# EAGLE schematic EurorackSP32 (EAGLE 9.6.2)
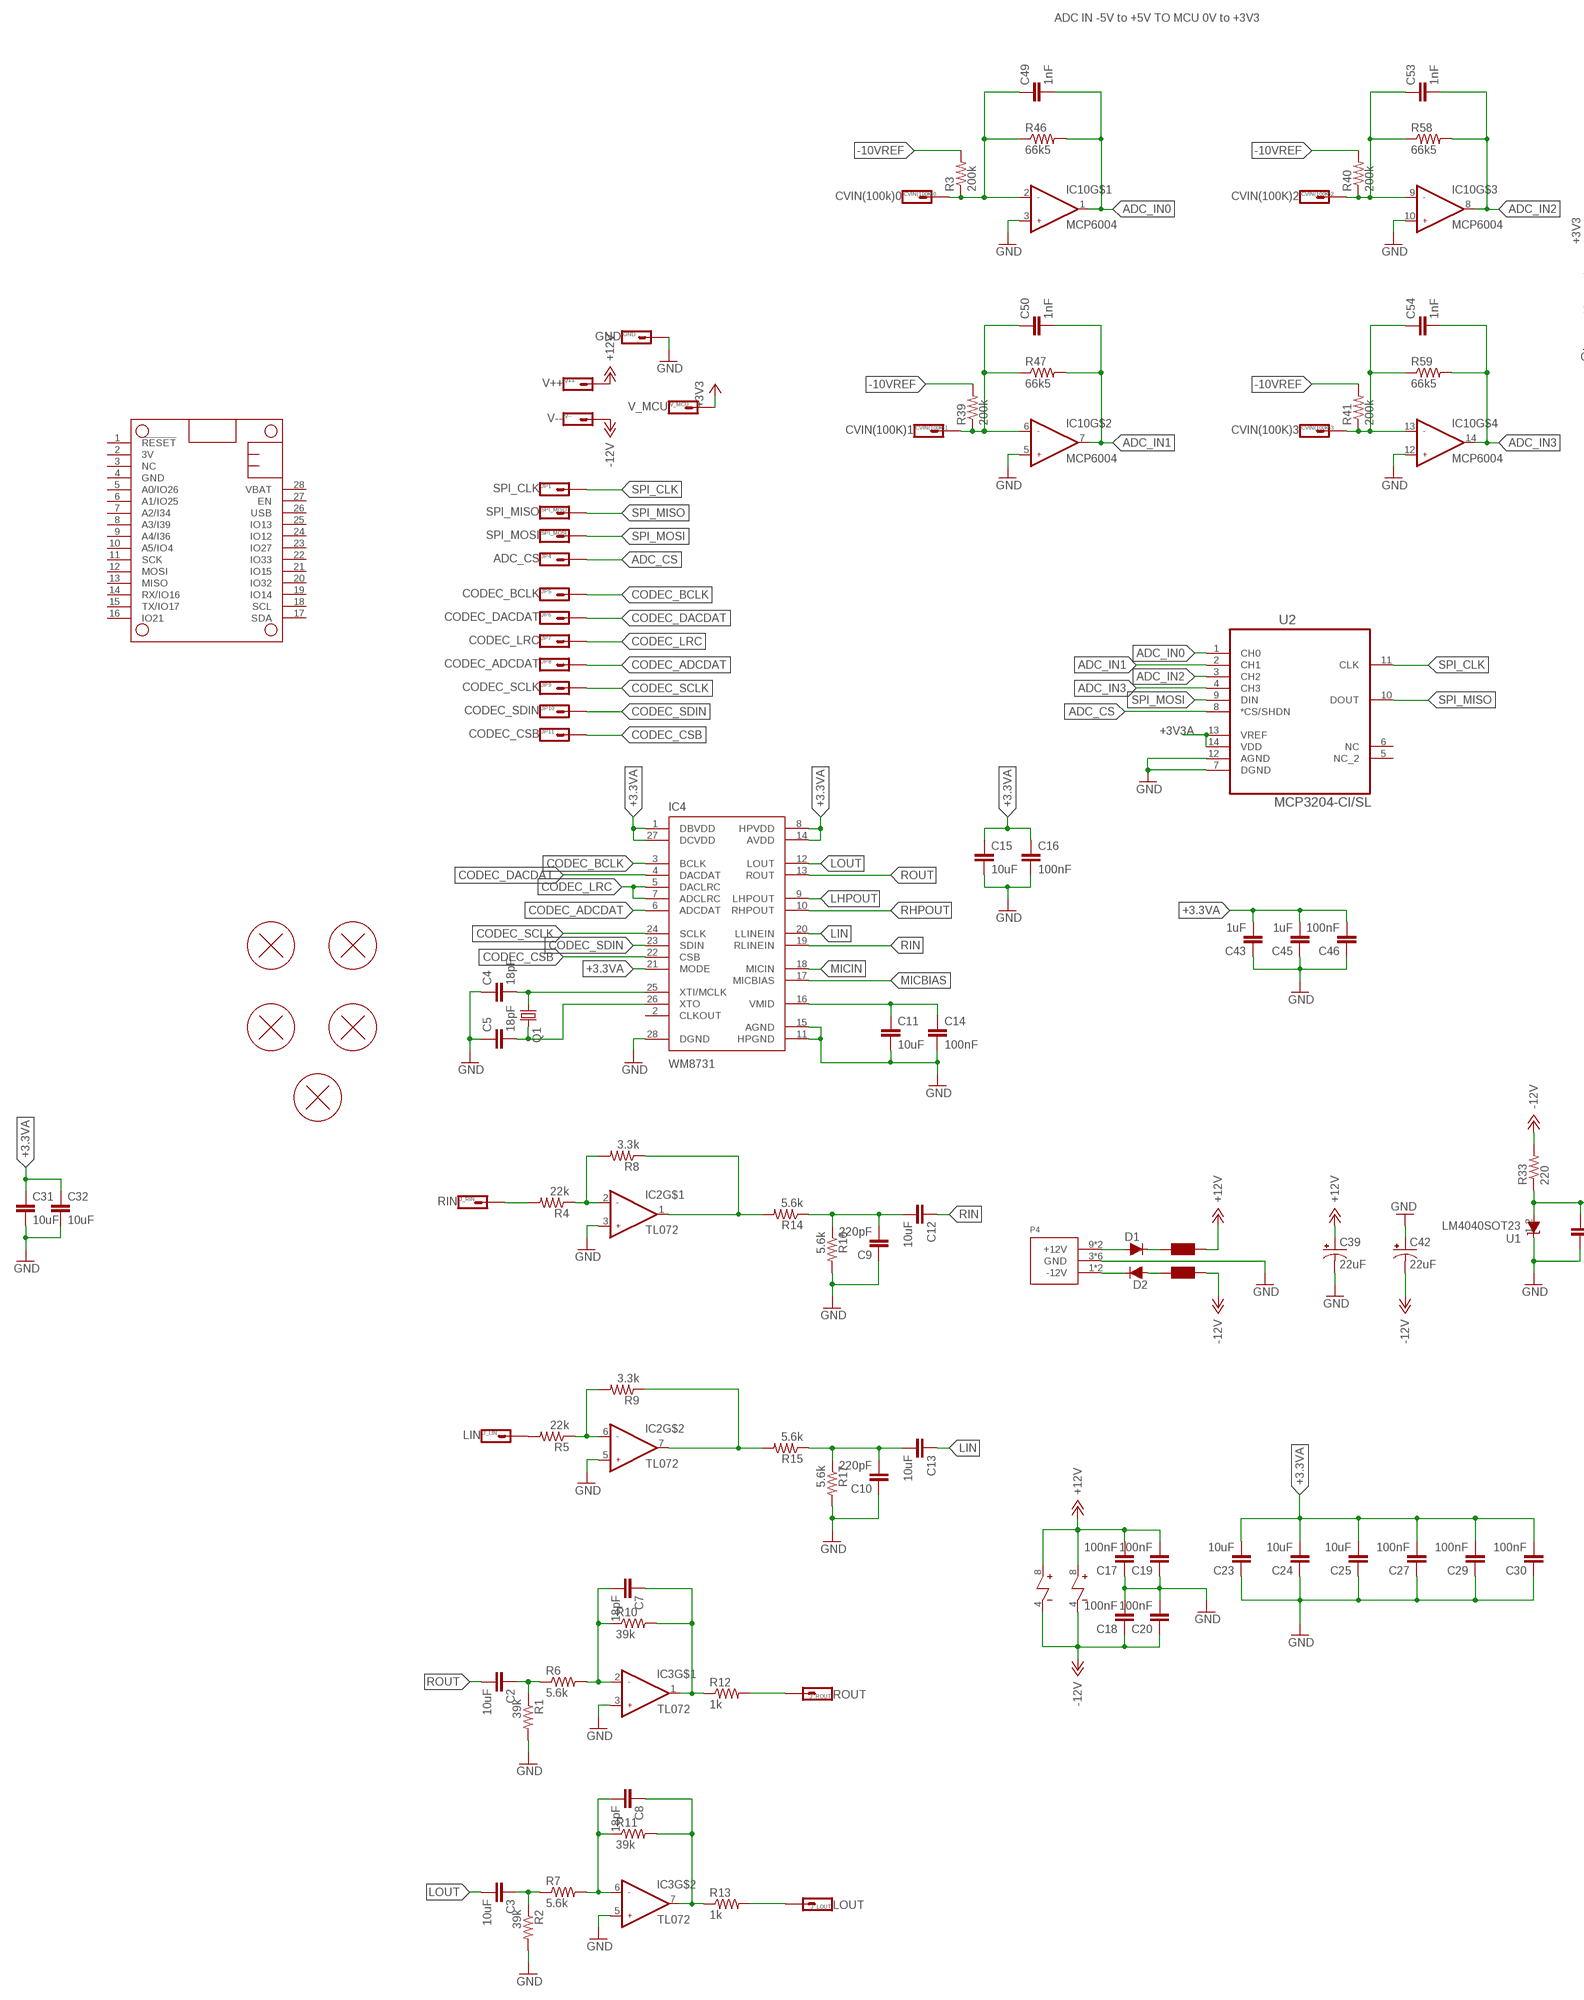
[diagram p0: schematic, sheet 1, part 1 of 2]
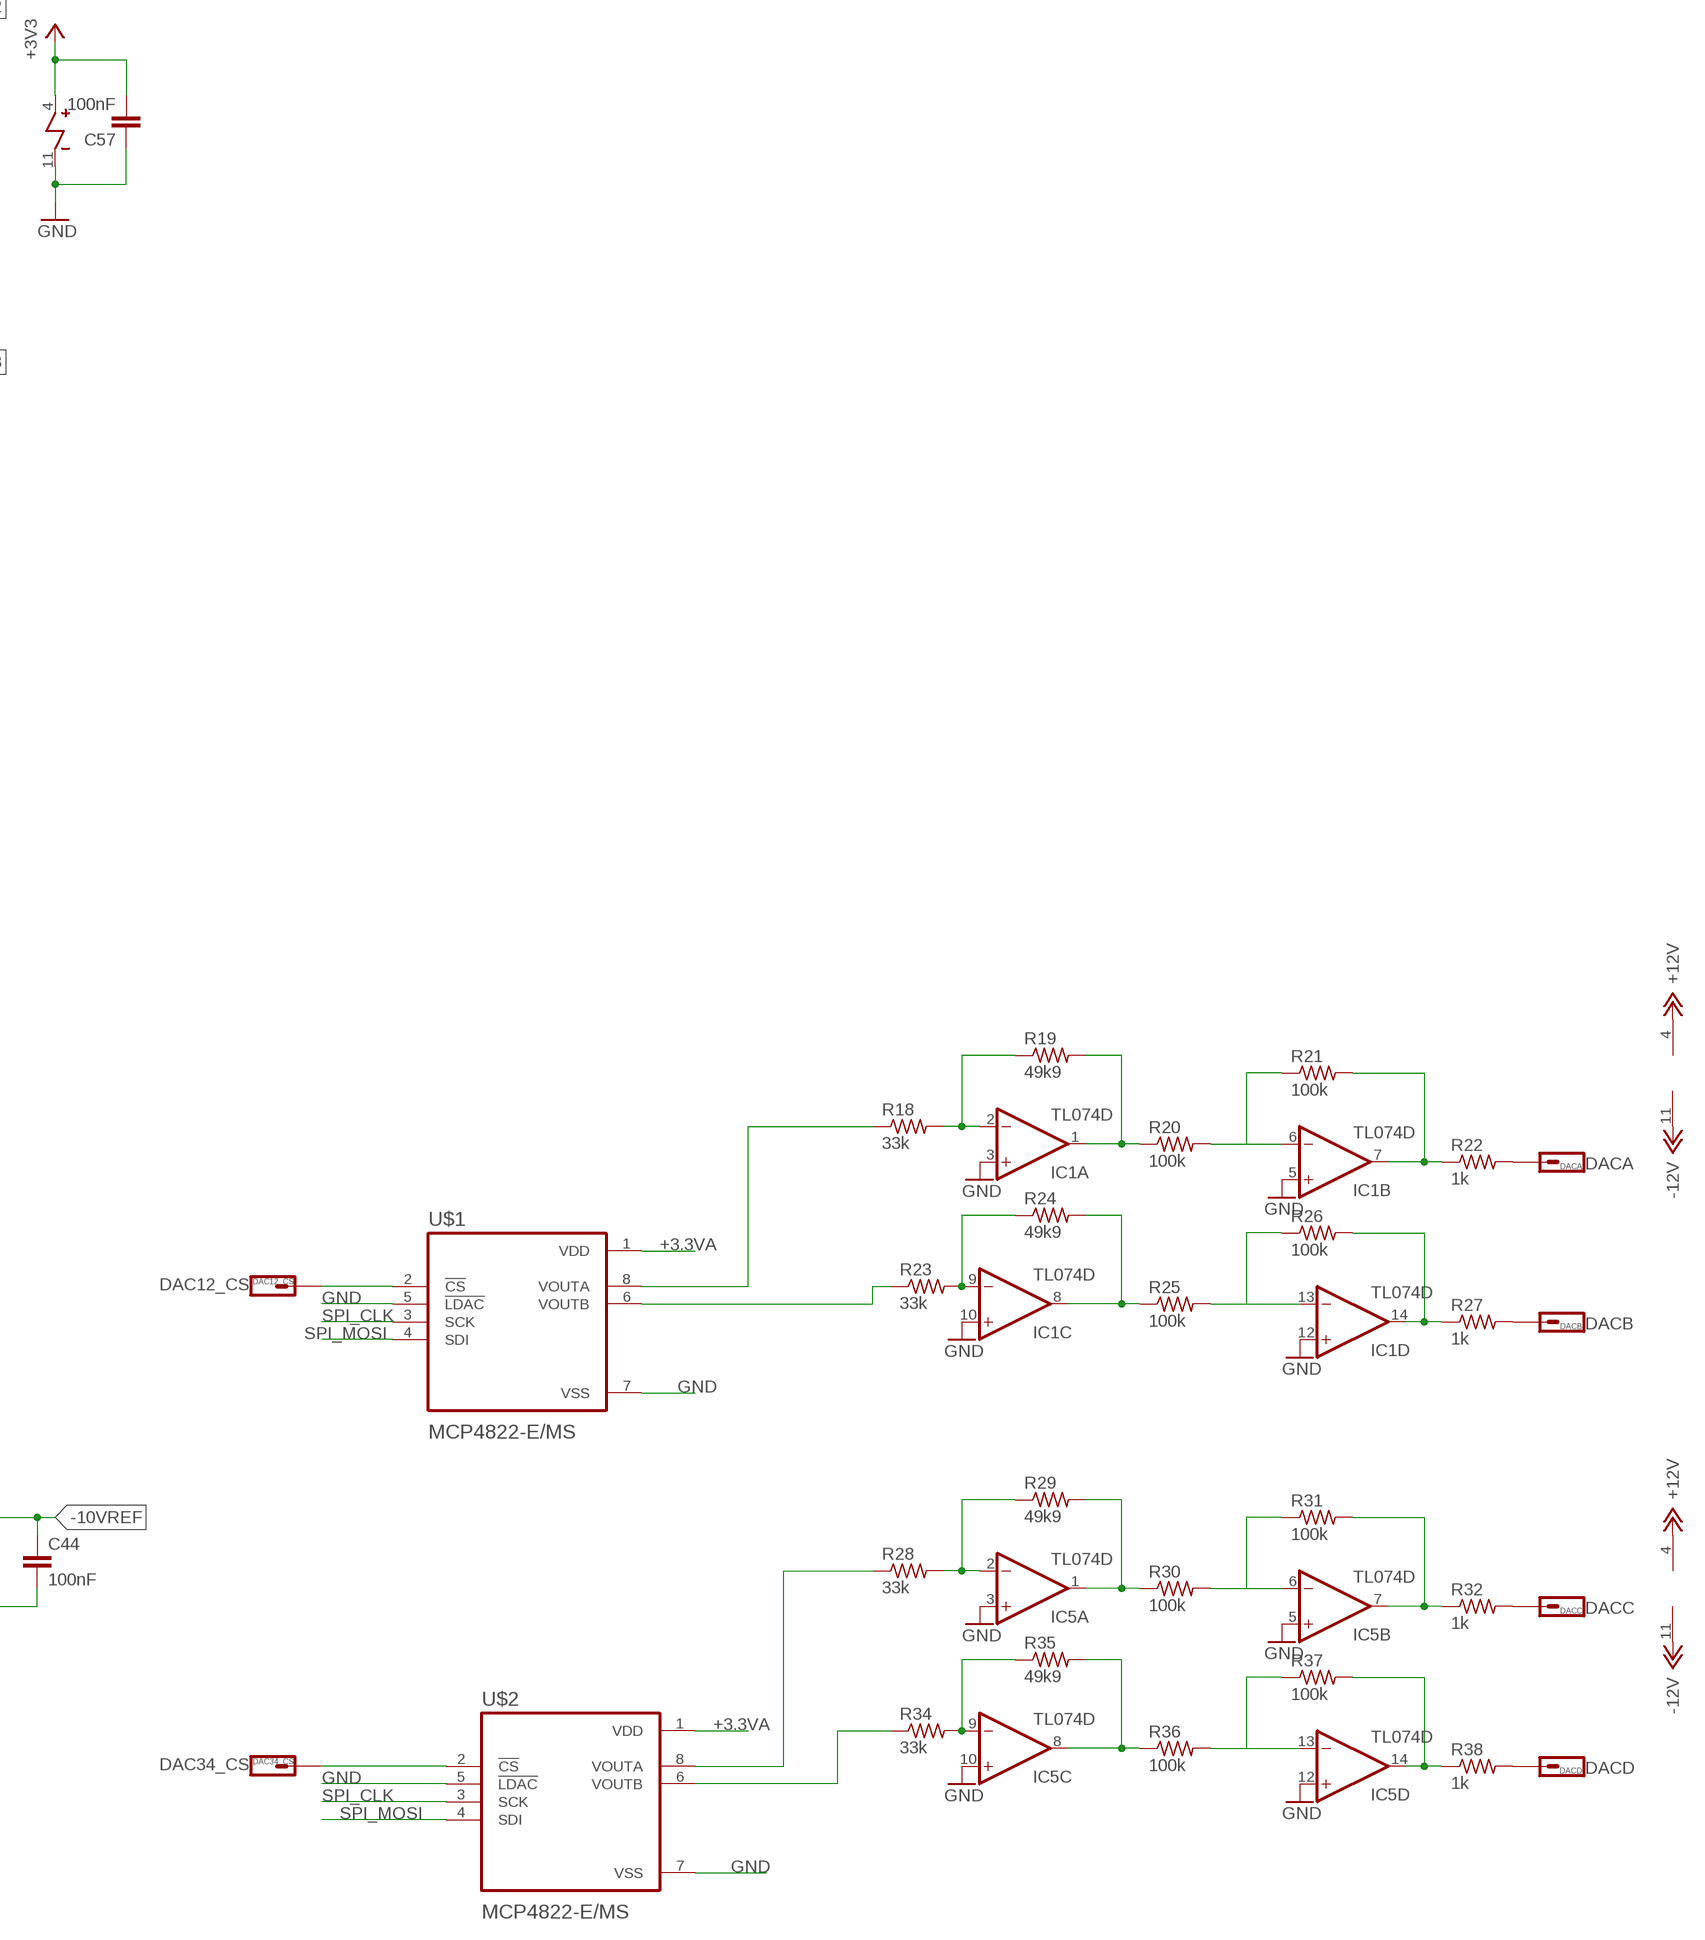
[diagram p1: schematic, sheet 1, part 2 of 2]

## Parts
C2  10uF  CAPACITOR0805  [R0805]
C3  10uF  CAPACITOR0805  [R0805]
C4  18pF  CAPACITOR  [RESISTOR_0603]
C5  18pF  CAPACITOR  [RESISTOR_0603]
C7  18pF  CAPACITOR  [RESISTOR_0603]
C8  18pF  CAPACITOR  [RESISTOR_0603]
C9  220pF  CAPACITOR  [RESISTOR_0603]
C10  220pF  CAPACITOR  [RESISTOR_0603]
C11  10uF  CAPACITOR0805  [R0805]
C12  10uF  CAPACITOR0805  [R0805]
C13  10uF  CAPACITOR0805  [R0805]
C14  100nF  CAPACITOR  [RESISTOR_0603]
C15  10uF  CAPACITOR0805  [R0805]
C16  100nF  CAPACITOR  [RESISTOR_0603]
C17  100nF  CAPACITOR  [RESISTOR_0603]
C18  100nF  CAPACITOR  [RESISTOR_0603]
C19  100nF  CAPACITOR  [RESISTOR_0603]
C20  100nF  CAPACITOR  [RESISTOR_0603]
C23  10uF  CAPACITOR0805  [R0805]
C24  10uF  CAPACITOR0805  [R0805]
C25  10uF  CAPACITOR0805  [R0805]
C27  100nF  CAPACITOR  [RESISTOR_0603]
C29  100nF  CAPACITOR  [RESISTOR_0603]
C30  100nF  CAPACITOR  [RESISTOR_0603]
C31  10uF  CAPACITOR0805  [R0805]
C32  10uF  CAPACITOR0805  [R0805]
C39  22uF  CAP_POL1206_TANT  [1206_POL]
C42  22uF  CAP_POL1206_TANT  [1206_POL]
C43  1uF  CAPACITOR  [RESISTOR_0603]
C44  100nF  CAPACITOR  [RESISTOR_0603]
C45  1uF  CAPACITOR  [RESISTOR_0603]
C46  100nF  CAPACITOR  [RESISTOR_0603]
C49  1nF  CAPACITOR  [RESISTOR_0603]
C50  1nF  CAPACITOR  [RESISTOR_0603]
C53  1nF  CAPACITOR  [RESISTOR_0603]
C54  1nF  CAPACITOR  [RESISTOR_0603]
C57  100nF  CAPACITOR  [RESISTOR_0603]
CVIN(100K)0  CVIN(100k)0  HEADER-1X1  [1X01_SIDE_NAME]
CVIN(100K)1  CVIN(100K)1  HEADER-1X1  [1X01_SIDE_NAME]
CVIN(100K)2  CVIN(100K)2  HEADER-1X1  [1X01_SIDE_NAME]
CVIN(100K)3  CVIN(100K)3  HEADER-1X1  [1X01_SIDE_NAME]
D1  DIODE  [SOD123]
D2  DIODE  [SOD123]
DAC12_CS  DAC12_CS  HEADER-1X1  [1X01_SIDE_NAME]
DAC34_CS  DAC34_CS  HEADER-1X1  [1X01_SIDE_NAME]
DACA  DACA  HEADER-1X1  [1X01_SIDE_NAME]
DACB  DACB  HEADER-1X1  [1X01_SIDE_NAME]
DACC  DACC  HEADER-1X1  [1X01_SIDE_NAME]
DACD  DACD  HEADER-1X1  [1X01_SIDE_NAME]
F1  FERRITE-BEAD0805  [R0805]
F2  FERRITE-BEAD0805  [R0805]
GND  GND  HEADER-1X1  [1X01_SIDE_NAME]
H1  PCB_SCREW  [PCB_SCREW]
H2  PCB_SCREW  [PCB_SCREW]
H3  PCB_SCREW  [PCB_SCREW]
H4  PCB_SCREW  [PCB_SCREW]
H5  PCB_SCREW  [PCB_SCREW]
IC1  TL074D  [SO14]
IC2  TL072  OPAMP_DUAL  [SOIC8]
IC3  TL072  OPAMP_DUAL  [SOIC8]
IC4  WM8731  [SSOP28]
IC5  TL074D  [SO14]
IC10  MCP6004  OPAMP_QUADPWR  [TSSOP14]
J_LIN  LIN  HEADER-1X1  [1X01_SIDE_NAME]
J_LOUT  LOUT  HEADER-1X1  [1X01_SIDE_NAME]
J_RIN  RIN  HEADER-1X1  [1X01_SIDE_NAME]
J_ROUT  ROUT  HEADER-1X1  [1X01_SIDE_NAME]
JP1  SPI_CLK  HEADER-1X1  [1X01_SIDE_NAME]
JP4  ADC_CS  HEADER-1X1  [1X01_SIDE_NAME]
JP5  CODEC_BCLK  HEADER-1X1  [1X01_SIDE_NAME]
JP6  CODEC_DACDAT  HEADER-1X1  [1X01_SIDE_NAME]
JP7  CODEC_LRC  HEADER-1X1  [1X01_SIDE_NAME]
JP8  CODEC_ADCDAT  HEADER-1X1  [1X01_SIDE_NAME]
JP9  CODEC_SCLK  HEADER-1X1  [1X01_SIDE_NAME]
JP10  CODEC_SDIN  HEADER-1X1  [1X01_SIDE_NAME]
JP11  CODEC_CSB  HEADER-1X1  [1X01_SIDE_NAME]
MS2  FEATHER_HUZZAH32NO_DRILL  [FEATHERWING_NODRILL]
P4  POWER_SIMPLE10  [POWER_10]
Q1  CRYSTAL  [HC49UP]
R1  39k  RESISTOR  [RESISTOR_0603]
R2  39k  RESISTOR  [RESISTOR_0603]
R3  200k  RESISTOR  [RESISTOR_0603]
R4  22k  RESISTOR  [RESISTOR_0603]
R5  22k  RESISTOR  [RESISTOR_0603]
R6  5.6k  RESISTOR  [RESISTOR_0603]
R7  5.6k  RESISTOR  [RESISTOR_0603]
R8  3.3k  RESISTOR  [RESISTOR_0603]
R9  3.3k  RESISTOR  [RESISTOR_0603]
R10  39k  RESISTOR  [RESISTOR_0603]
R11  39k  RESISTOR  [RESISTOR_0603]
R12  1k  RESISTOR  [RESISTOR_0603]
R13  1k  RESISTOR  [RESISTOR_0603]
R14  5.6k  RESISTOR  [RESISTOR_0603]
R15  5.6k  RESISTOR  [RESISTOR_0603]
R16  5.6k  RESISTOR  [RESISTOR_0603]
R17  5.6k  RESISTOR  [RESISTOR_0603]
R18  33k  RESISTOR  [RESISTOR_0603]
R19  49k9  RESISTOR  [RESISTOR_0603]
R20  100k  RESISTOR  [RESISTOR_0603]
R21  100k  RESISTOR  [RESISTOR_0603]
R22  1k  RESISTOR  [RESISTOR_0603]
R23  33k  RESISTOR  [RESISTOR_0603]
R24  49k9  RESISTOR  [RESISTOR_0603]
R25  100k  RESISTOR  [RESISTOR_0603]
R26  100k  RESISTOR  [RESISTOR_0603]
R27  1k  RESISTOR  [RESISTOR_0603]
R28  33k  RESISTOR  [RESISTOR_0603]
R29  49k9  RESISTOR  [RESISTOR_0603]
R30  100k  RESISTOR  [RESISTOR_0603]
R31  100k  RESISTOR  [RESISTOR_0603]
R32  1k  RESISTOR  [RESISTOR_0603]
R33  220  RESISTOR  [RESISTOR_0603]
R34  33k  RESISTOR  [RESISTOR_0603]
R35  49k9  RESISTOR  [RESISTOR_0603]
R36  100k  RESISTOR  [RESISTOR_0603]
R37  100k  RESISTOR  [RESISTOR_0603]
R38  1k  RESISTOR  [RESISTOR_0603]
R39  200k  RESISTOR  [RESISTOR_0603]
R40  200k  RESISTOR  [RESISTOR_0603]
R41  200k  RESISTOR  [RESISTOR_0603]
R46  66k5  RESISTOR  [RESISTOR_0603]
R47  66k5  RESISTOR  [RESISTOR_0603]
R58  66k5  RESISTOR  [RESISTOR_0603]
R59  66k5  RESISTOR  [RESISTOR_0603]
SPI_MISO  SPI_MISO  HEADER-1X1  [1X01_SIDE_NAME]
SPI_MOSI  SPI_MOSI  HEADER-1X1  [1X01_SIDE_NAME]
U1  LM4040SOT23  [SOT23]
U2  MCP3204-CI/SL  [SOIC127P600X175-14N]
U$1  MCP4822-E/MS  [SOP65P490X110-8N]
U$2  MCP4822-E/MS  [SOP65P490X110-8N]
V++  V++  HEADER-1X1  [1X01_SIDE_NAME]
V--  V--  HEADER-1X1  [1X01_SIDE_NAME]
V_MCU  V_MCU  HEADER-1X1  [1X01_SIDE_NAME]

## Nets
+3.3VA: C15.1 C16.1 C23.2 C24.2 C25.2 C27.2 C29.2 C30.2 C31.1 C32.1 C43.2 C45.2 C46.2 IC4.1(DBVDD) IC4.8(HPVDD) IC4.14(AVDD) IC4.21(MODE) IC4.27(DCVDD) U$1.1(VDD) U$2.1(VDD)
+3V3: C57.2 IC10.4 V_MCU.1
+3V3A: U2.13(VREF) U2.14(VDD)
+12V: C17.2 C19.2 C39.2(+) F1.1 IC1.4(P:V+) IC2.8 IC3.8 IC5.4(P:V+) V++.1
-10VREF: C44.1 R3.2 R33.1 R39.2 R40.2 R41.2 U1.2(A)
-12V: C18.1 C20.1 C42.1(-) F2.1 IC1.11(P:V-) IC2.4 IC3.4 IC5.11(P:V-) R33.2 V--.1
ADC_CS: JP4.1 U2.8(*CS/SHDN)
ADC_IN0: C49.2 IC10.1 R46.2 U2.1(CH0)
ADC_IN1: C50.2 IC10.7 R47.2 U2.2(CH1)
ADC_IN2: C53.2 IC10.8 R58.2 U2.3(CH2)
ADC_IN3: C54.2 IC10.14 R59.2 U2.4(CH3)
CODEC_ADCDAT: IC4.6(ADCDAT) JP8.1
CODEC_BCLK: IC4.3(BCLK) JP5.1
CODEC_CSB: IC4.22(CSB) JP11.1
CODEC_DACDAT: IC4.4(DACDAT) JP6.1
CODEC_LRC: IC4.5(DACLRC) IC4.7(ADCLRC) JP7.1
CODEC_SCLK: IC4.24(SCLK) JP9.1
CODEC_SDIN: IC4.23(SDIN) JP10.1
DAC_B: R23.1 U$1.6(VOUTB)
DAC_D: R34.1 U$2.6(VOUTB)
GND: C4.1 C5.1 C9.1 C10.1 C11.2 C14.2 C15.2 C16.2 C17.1 C18.2 C19.1 C20.2 C23.1 C24.1 C25.1 C27.1 C29.1 C30.1 C31.2 C32.2 C39.1(-) C42.2(+) C43.1 C44.2 C45.1 C46.1 C57.1 GND.1 IC1.3(A:+IN) IC1.5(B:+IN) IC1.10(C:+IN) IC1.12(D:+IN) IC2.3 IC2.5 IC3.3 IC3.5 IC4.11(HPGND) IC4.15(AGND) IC4.28(DGND) IC5.3(A:+IN) IC5.5(B:+IN) IC5.10(C:+IN) IC5.12(D:+IN) IC10.3 IC10.5 IC10.10 IC10.11 IC10.12 P4.3(GND) P4.4(GND) P4.5(GND) P4.6(GND) P4.7(GND) P4.8(GND) R1.2 R2.2 R16.2 R17.2 U1.1(C) U2.7(DGND) U2.12(AGND) U$1.5(!LDAC) U$1.7(VSS) U$2.5(!LDAC) U$2.7(VSS)
LHPOUT: IC4.9(LHPOUT)
LIN: C13.1 IC4.20(LLINEIN)
LOUT: C3.2 IC4.12(LOUT)
MICBIAS: IC4.17(MICBIAS)
MICIN: IC4.18(MICIN)
N$1: J_LIN.1 R5.2
N$2: J_LOUT.1 R13.2
N$3: J_ROUT.1 R12.2
N$4: IC1.2(A:-IN) R18.2 R19.1
N$5: IC1.7(B:OUT) R21.2 R22.1
N$6: IC1.9(C:-IN) R23.2 R24.1
N$7: IC1.6(B:-IN) R20.2 R21.1
N$8: IC1.1(A:OUT) R19.2 R20.1
N$9: IC1.14(D:OUT) R26.2 R27.1
N$10: IC1.13(D:-IN) R25.2 R26.1
N$11: IC1.8(C:OUT) R24.2 R25.1
N$12: IC5.2(A:-IN) R28.2 R29.1
N$13: IC5.7(B:OUT) R31.2 R32.1
N$14: IC5.6(B:-IN) R30.2 R31.1
N$15: C53.1 CVIN(100K)2.1 IC10.9 R40.1 R58.1
N$16: IC5.1(A:OUT) R29.2 R30.1
N$17: C49.1 CVIN(100K)0.1 IC10.2 R3.1 R46.1
N$18: IC5.9(C:-IN) R34.2 R35.1
N$19: C50.1 CVIN(100K)1.1 IC10.6 R39.1 R47.1
N$20: IC5.14(D:OUT) R37.2 R38.1
N$21: C54.1 CVIN(100K)3.1 IC10.13 R41.1 R59.1
N$22: IC5.13(D:-IN) R36.2 R37.1
N$23: IC5.8(C:OUT) R35.2 R36.1
N$24: R18.1 U$1.8(VOUTA)
N$25: DACA.1 R22.2
N$26: R28.1 U$2.8(VOUTA)
N$27: DACB.1 R27.2
N$28: DAC12_CS.1 U$1.2(!CS)
N$29: DACC.1 R32.2
N$31: J_RIN.1 R4.2
N$32: IC2.2 R4.1 R8.2
N$33: D1.+ P4.9(+12V) P4.10(+12V)
N$34: DACD.1 R38.2
N$36: IC2.1 R8.1 R14.2
N$37: C9.2 C12.2 R14.1 R16.1
N$40: IC2.6 R5.1 R9.2
N$42: IC2.7 R9.1 R15.2
N$43: C5.2 IC4.26(XTO) Q1.2
N$44: C4.2 IC4.25(XTI/MCLK) Q1.1
N$45: C10.2 C13.2 R15.1 R17.1
N$46: C7.1 IC3.1 R10.2 R12.1
N$47: D1.- F1.2
N$48: C7.2 IC3.2 R6.2 R10.1
N$49: C2.1 R1.1 R6.1
N$51: DAC34_CS.1 U$2.2(!CS)
N$53: D2.- P4.1(-12V) P4.2(-12V)
N$54: C8.1 IC3.7 R11.2 R13.1
N$55: C8.2 IC3.6 R7.2 R11.1
N$56: C11.1 C14.1 IC4.16(VMID)
N$57: C3.1 R2.1 R7.1
N$59: D2.+ F2.2
RHPOUT: IC4.10(RHPOUT)
RIN: C12.1 IC4.19(RLINEIN)
ROUT: C2.2 IC4.13(ROUT)
SPI_CLK: JP1.1 U2.11(CLK) U$1.3(SCK) U$2.3(SCK)
SPI_MISO: SPI_MISO.1 U2.10(DOUT)
SPI_MOSI: SPI_MOSI.1 U2.9(DIN) U$1.4(SDI) U$2.4(SDI)
Unconnected: IC4.2(CLKOUT) MS2.1(!RESET) MS2.2(3V) MS2.3(NC) MS2.5(A0/IO26) MS2.6(A1/IO25) MS2.7(A2/I34) MS2.8(A3/I39) MS2.9(A4/I36) MS2.10(A5/IO4) MS2.11(SCK) MS2.12(MOSI) MS2.13(MISO) MS2.14(RX/IO16) MS2.15(TX/IO17) MS2.16(IO21) MS2.17(SDA) MS2.18(SCL) MS2.19(IO14) MS2.20(IO32) MS2.21(IO15) MS2.22(IO33) MS2.23(IO27) MS2.24(IO12) MS2.25(IO13) MS2.26(USB) MS2.27(EN) MS2.28(VBAT) U2.5(NC_2) U2.6(NC)

## Notes on the sheet
- ADC IN -5V to +5V TO MCU 0V to +3V3

## Power pins joined to a net without a drawn wire
GND: MS2.4(GND)

## Library data of the parts
C2-C5 C7-C20 C23-C25 C27 C29-C32 C43-C46 C49 C50 C53 C54 C57 = parts_aman:CAPACITOR
C39 C42 = parts_aman:CAP_POL
CVIN(100K)0 CVIN(100K)1-CVIN(100K)3 DAC12_CS DAC34_CS DACA DACB DACC DACD GND J_LIN J_LOUT J_RIN J_ROUT JP1 JP4-JP11 SPI_MISO SPI_MOSI V++ V-- V_MCU = TOF:HEADER-1X1: Header 1 Standard 1-pin 0.1" header. Use with straight break away headers (SKU : PRT-00116), right angle break away headers (PRT-00553), swiss pins (PRT-00743), machine pins (PRT-00117), and female headers (PRT-00115).
D1 D2 = parts_aman:DIODE
F1 F2 = parts_aman:FERRITE-BEAD
H1-H5 = parts_aman:PCB_SCREW
IC1 IC5 = linear:TL074: OP AMP
IC2 IC3 = parts_aman:OPAMP_DUAL
IC4 = og-dac:WM8731
IC10 = parts_aman:OPAMP_QUAD
MS2 = TOF:FEATHER_HUZZAH32
P4 = parts_aman:POWER_SIMPLE
Q1 = parts_aman:CRYSTAL
R1-R41 R46 R47 R58 R59 = parts_aman:RESISTOR
U1 = parts_aman:LM4040
U2 = TOF:MCP3204-CI/SL: IC ADC 12BIT 2.7V 4CH SPI; MPN: MCP3204-CI/SL; OC_FARNELL: 1196795; OC_NEWARK: 26M1276; PACKAGE: 14 - SOIC; SUPPLIER: Microchip
U$1 U$2 = TOF:MCP4822-E/MS: Check prices <https://pricing.snapeda.com/parts/MCP4822-E/MS/Microchip%20Technology/view-part?ref=eda>; AVAILABILITY: Warning; DESCRIPTION: 12 Bit Digital to Analog Converter 2 8-MSOP; MF: Microchip Technology; MP: MCP4822-E/MS; PACKAGE: MSOP-8 Microchip; PRICE: None; PURCHASE-URL: https://pricing.snapeda.com/search/part/MCP4822-E/MS/?ref=eda